# EAGLE design oneboard2 (EAGLE 7.5.0)
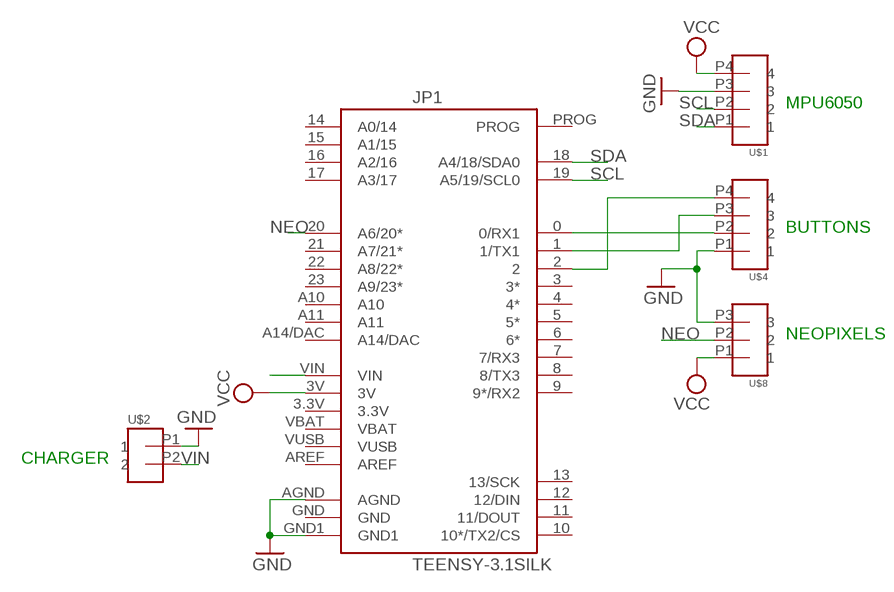
[diagram p0: schematic, sheet 1]

## Parts
JP1  TEENSY-3.1SILK  [TEENSY-3.1]
U$1  PTSM0,4-HH-2,5-SMD-R44  [M04_SMD_RIGHT]
U$2  PTSM0,2-HH-2,5-SMD-R32  [M02_SMD_RIGHT]
U$4  PTSM0,4-HH-2,5-SMD-R44  [M04_SMD_RIGHT]
U$8  PTSM0,3-HH-2,5-SMD-R44  [M03_SMD_RIGHT]

## Nets
GND: JP1.AGND JP1.GND1 U$1.P3 U$2.P1 U$4.P1 U$8.P3
N$1: JP1.1(1/TX1) U$4.P3
N$2: JP1.0(0/RX1) U$4.P2
N$4: JP1.2 U$4.P4
NEO: JP1.20(A6/20*) U$8.P2
SCL: JP1.19(A5/19/SCL0) U$1.P2
SDA: JP1.18(A4/18/SDA0) U$1.P1
VCC: JP1.3V U$1.P4 U$8.P1
VIN: JP1.VIN U$2.P2
Unconnected: JP1.3(3*) JP1.3.3V JP1.4(4*) JP1.5(5*) JP1.6(6*) JP1.7(7/RX3) JP1.8(8/TX3) JP1.9(9*/RX2) JP1.10(10*/TX2/CS) JP1.11(11/DOUT) JP1.12(12/DIN) JP1.13(13/SCK) JP1.14(A0/14) JP1.15(A1/15) JP1.16(A2/16) JP1.17(A3/17) JP1.21(A7/21*) JP1.22(A8/22*) JP1.23(A9/23*) JP1.A10 JP1.A11 JP1.A14/DAC JP1.AREF JP1.GND JP1.PROG JP1.VBAT JP1.VUSB

## Notes on the sheet
- MPU6050
- BUTTONS
- NEOPIXELS
- CHARGER

## Library data of the parts
JP1 = SparkFun-Boards:TEENSY-3.1; SF_ID: DEV-12646
U$1 U$4 = PTSM_Connector:PTSM0,4-HH-2,5-SMD-R44
U$2 = PTSM_Connector:PTSM0,2-HH-2,5-SMD-R32
U$8 = PTSM_Connector:PTSM0,3-HH-2,5-SMD-R44

## Board
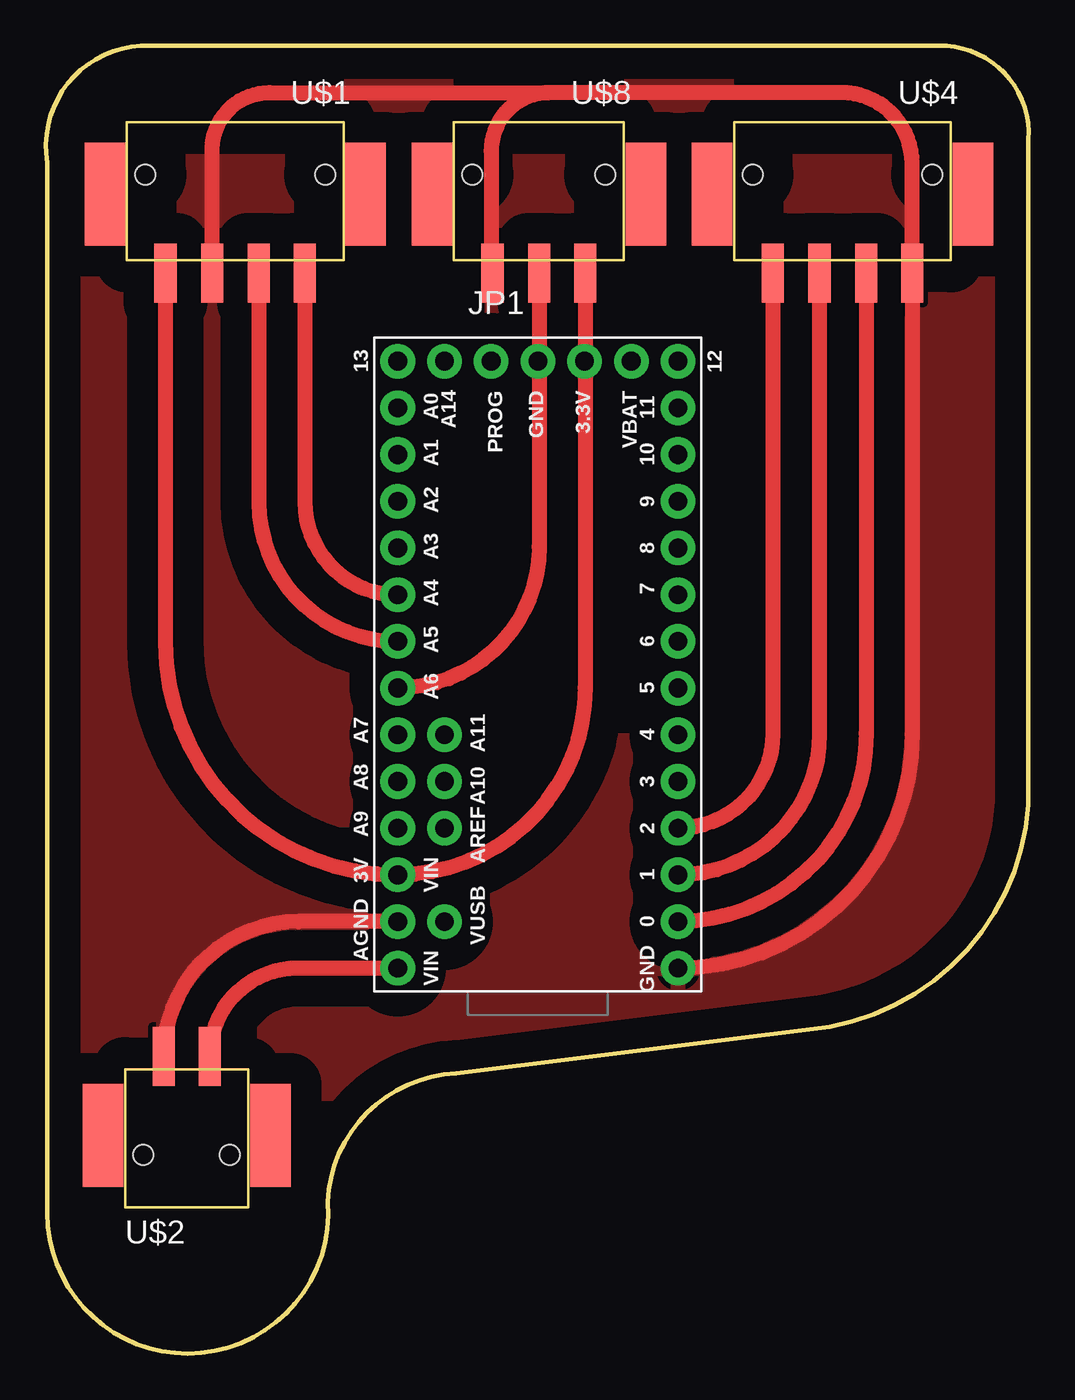
[diagram p1: board, top side]
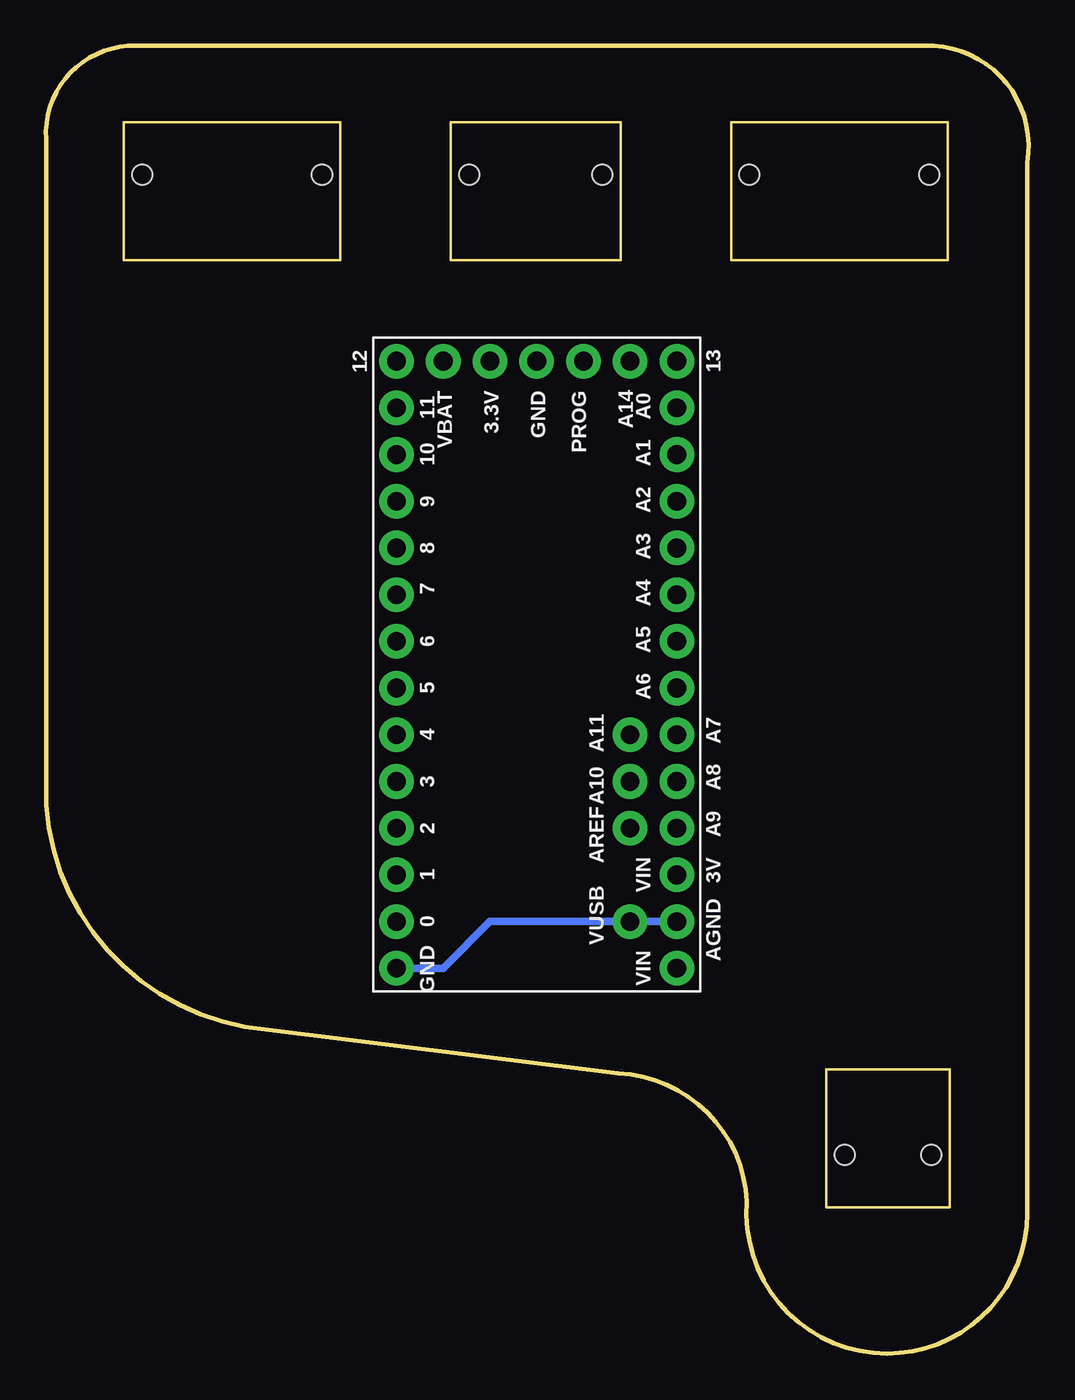
[diagram p2: board, bottom side, seen from below]

Size 53.43 x 71.12 mm. Coordinates in mm from the lower left corner, seen from the top.
Outline: 0.08,64.77 0.08,7.62 arc90 7.7,0 arc95 15.32,8.26 arc-85 22.3,15.24 42.62,17.78 arc76 53.42,29.84 53.42,66.04 arc90 48.97,71.12 5.16,71.12 arc97 0.08,64.77
Copper layers (1*16): Top 0.035mm / dielectric 1.5mm / Bottom 0.035mm
Design rules "default": minimum track width 10mil, minimum drill 24mil, track to track 8mil, track to pad 8mil, pad to pad 8mil, via to via 8mil, smd to smd 8mil, copper to edge 40mil, drill to drill 8mil, minimum pad ring 10mil, minimum via ring 8mil, stop-mask expansion 4mil, vias tented up to drill 0mil, thermal gap 10mil

### Footprints (pad centres in the part's own frame; a part is rotated, then mirrored left to right if it is on the bottom)
TEENSY-3.1 = drill 1.016 pad 1.88: 0 16.51,3.81; 1 16.51,6.35; 2 16.51,8.89; 3 16.51,11.43; 3.3V 11.43,34.29; 3V 1.27,6.35; 4 16.51,13.97; 5 16.51,16.51; 6 16.51,19.05; 7 16.51,21.59; 8 16.51,24.13; 9 16.51,26.67; 10 16.51,29.21; 11 16.51,31.75; 12 16.51,34.29; 13 1.27,34.29; 14 1.27,31.75; 15 1.27,29.21; 16 1.27,26.67; 17 1.27,24.13; 18 1.27,21.59; 19 1.27,19.05; 20 1.27,16.51; 21 1.27,13.97; 22 1.27,11.43; 23 1.27,8.89; A10 3.81,11.43; A11 3.81,13.97; A14/DAC 3.81,34.29; AGND 1.27,3.81; AREF 3.81,8.89; GND 8.89,34.29; GND1 16.51,1.27; PROG 6.35,34.29; VBAT 13.97,34.29; VIN 1.27,1.27; VUSB 3.81,3.81
M04_SMD_RIGHT = smd 2.2 x 5.6: B1 -7.14,1.07; B2 7.04,1.07 | smd 1.2 x 3.2: P1 -3.84,5.37; P2 -1.34,5.37; P3 1.2,5.37; P4 3.74,5.37 | hole 1.1: -4.94,0.02; 4.84,0.02
M02_SMD_RIGHT = smd 2.2 x 5.6: B1 -4.6,-0.2; B2 4.5,-0.2 | smd 1.2 x 3.2: P1 -1.3,4.1; P2 1.2,4.1 | hole 1.1: -2.4,-1.25; 2.3,-1.25
M03_SMD_RIGHT = smd 2.2 x 5.6: B1 -5.87,1.07; B2 5.77,1.07 | smd 1.2 x 3.2: P1 -2.57,5.37; P2 -0.07,5.37; P3 2.47,5.37 | hole 1.1: -3.67,0.02; 3.57,0.02

### Placement (x,y rotation side)
JP1  17.86,19.68 0 top
U$1  10.24,64.14 180 top
U$2  7.7,12.07 0 top
U$4  43.26,64.14 180 top
U$8  26.75,64.14 180 top

### Tracks (layer width: path | path; a pad name or v marks a point on that pad's centre or on a via)
GND
  Top 0.813: JP1.GND1 arc90 47.1,33.69 U$4.P1 47.1,64.74 arc90 43.26,68.58 27.38,68.58 | 27.38,68.58 arc90 24.21,65.41 24.21,58.84 arc90 U$8.P3 | U$1.P3 9.04,65.47 arc-90 12.14,68.58 27.38,68.58 | JP1.AGND 13.73,23.49 arc90 U$2.P1
  Bottom 0.406: JP1.AGND 29.29,23.49 31.83,20.95 JP1.GND1
  pour Top (isolate 1.676): -3.1,71.75 -3.1,-1.91 28.02,-1.91 55.96,-1.91 55.96,34.29 55.96,71.75
N$1
  Top 0.813: U$4.P3 42.06,33.73 arc-90 JP1.1
N$2
  Top 0.813: U$4.P2 44.6,33.73 arc-90 JP1.0
N$4
  Top 0.813: U$4.P4 39.52,33.73 arc-90 JP1.2
NEO
  Top 0.813: U$8.P2 26.82,43.88 arc-90 JP1.20
SCL
  Top 0.813: U$1.P2 11.58,46.28 arc90 JP1.19
SDA
  Top 0.813: U$1.P1 14.08,46.32 arc90 JP1.18
VCC
  Top 0.813: U$1.P4 6.5,38.66 arc90 JP1.3V arc90 29.32,36.23 U$8.P1
VIN
  Top 0.813: JP1.VIN 13.69,20.95 arc90 U$2.P2